# EAGLE design Ionic_Skin_Sensorized_Glove (EAGLE 8.2.1)
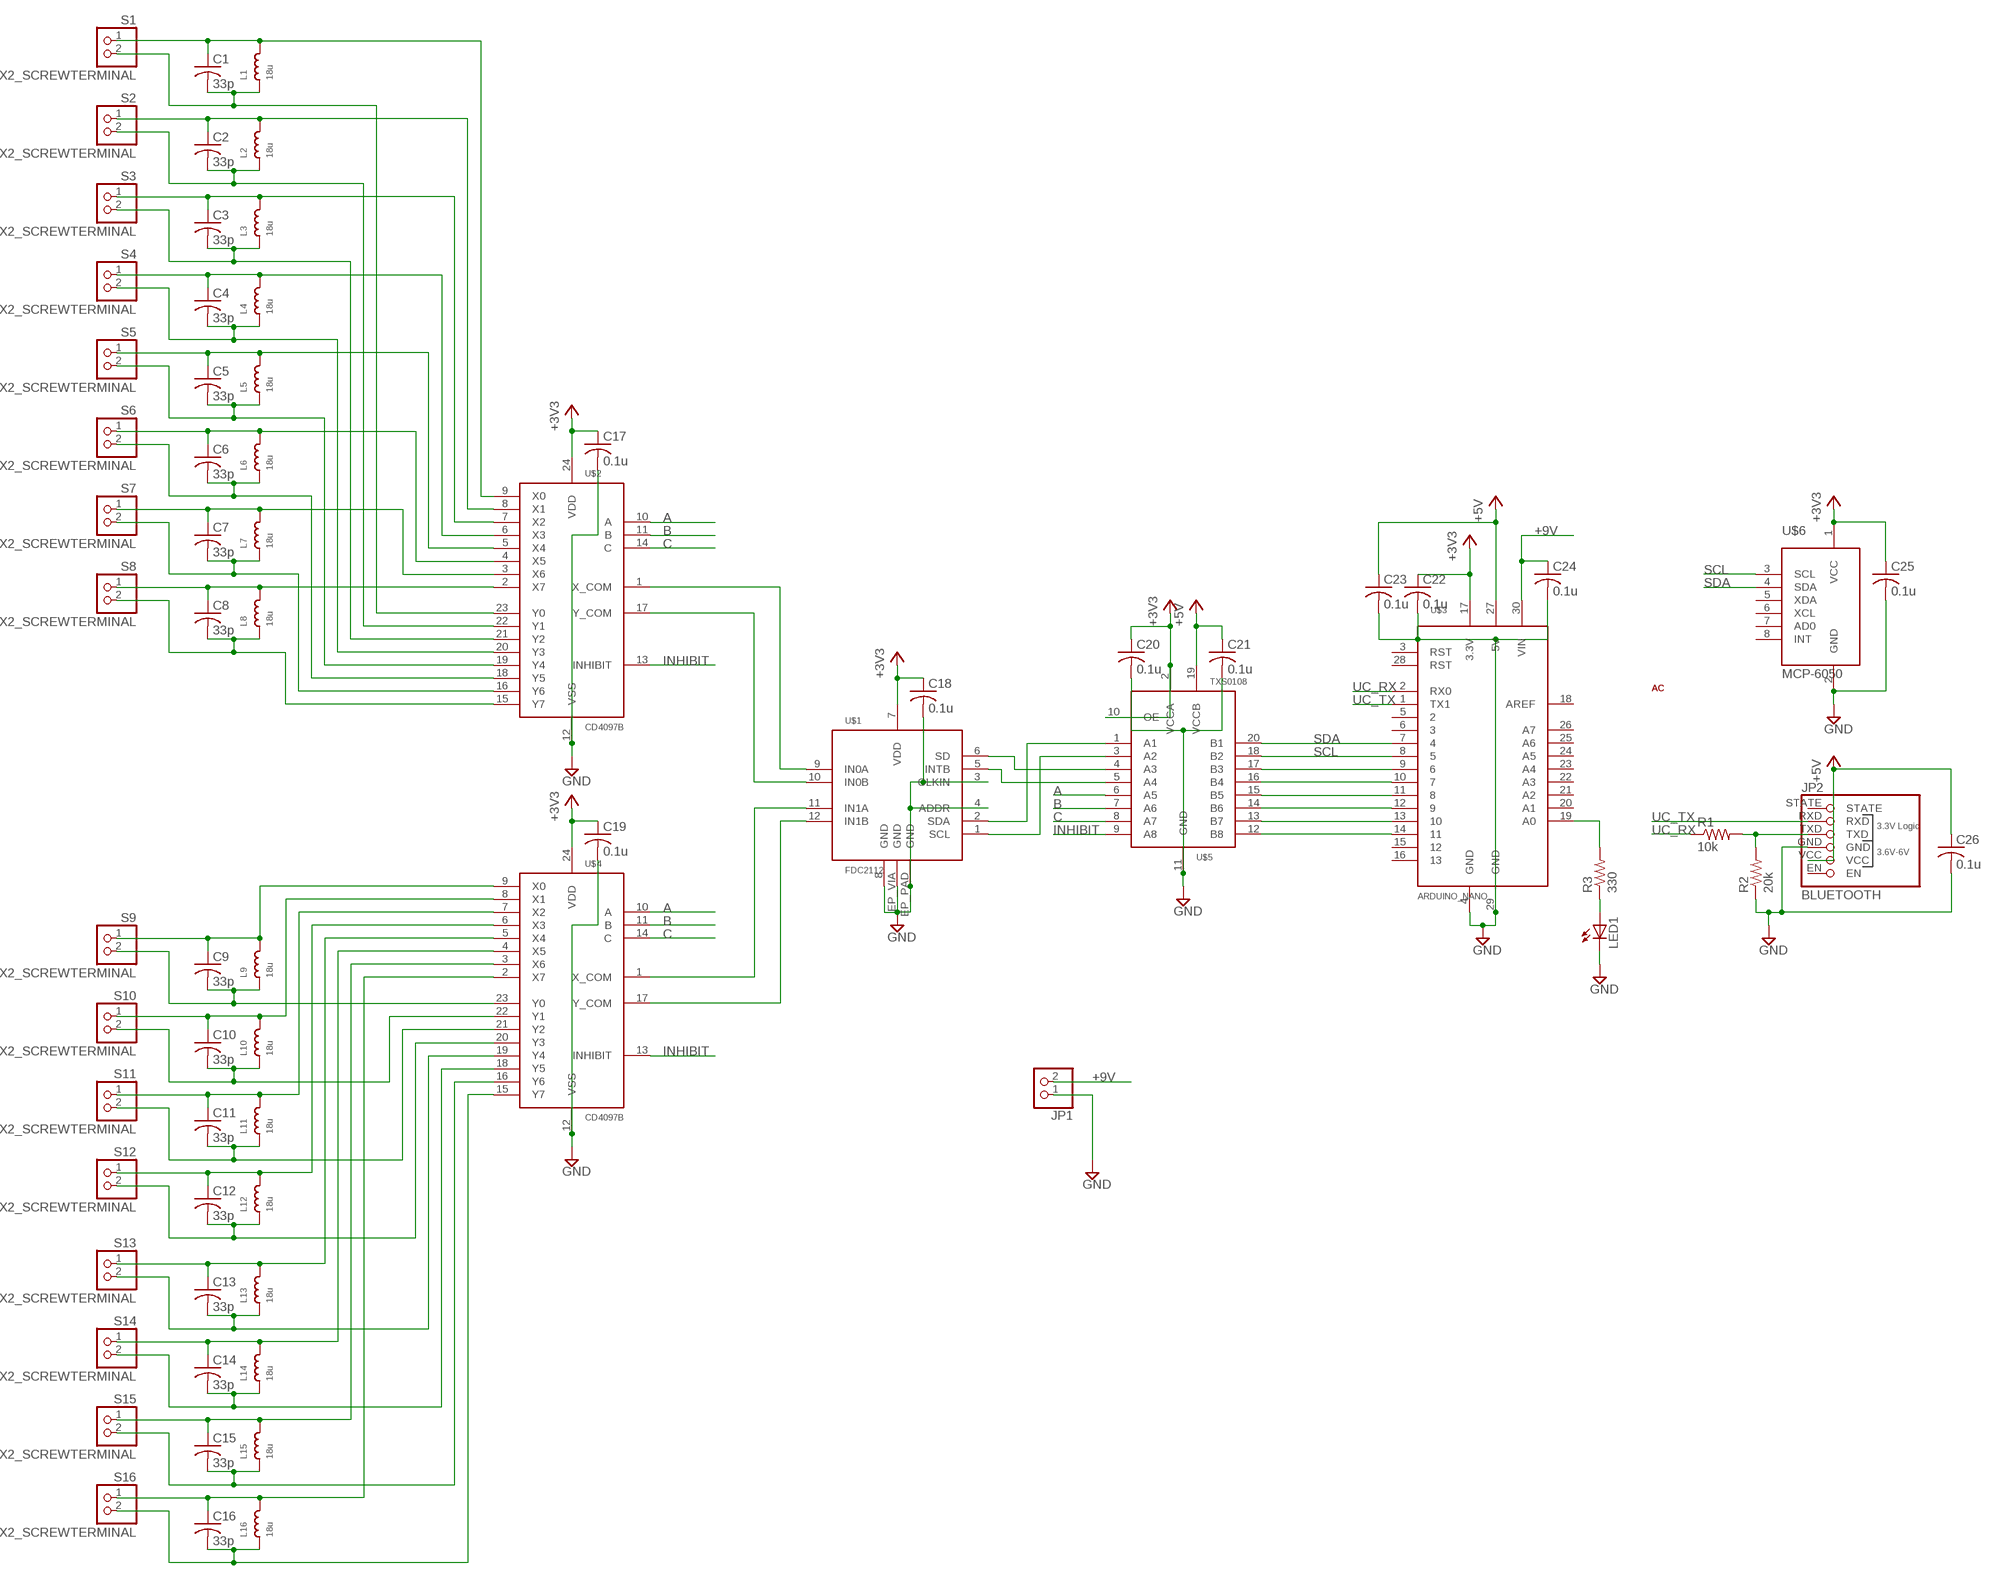
[diagram p0: schematic, sheet 1]

## Parts
C1  33p  C-USC0805  [C0805]
C2  33p  C-USC0805  [C0805]
C3  33p  C-USC0805  [C0805]
C4  33p  C-USC0805  [C0805]
C5  33p  C-USC0805  [C0805]
C6  33p  C-USC0805  [C0805]
C7  33p  C-USC0805  [C0805]
C8  33p  C-USC0805  [C0805]
C9  33p  C-USC0805  [C0805]
C10  33p  C-USC0805  [C0805]
C11  33p  C-USC0805  [C0805]
C12  33p  C-USC0805  [C0805]
C13  33p  C-USC0805  [C0805]
C14  33p  C-USC0805  [C0805]
C15  33p  C-USC0805  [C0805]
C16  33p  C-USC0805  [C0805]
C17  0.1u  C-USC0805  [C0805]
C18  0.1u  C-USC0805  [C0805]
C19  0.1u  C-USC0805  [C0805]
C20  0.1u  C-USC0805  [C0805]
C21  0.1u  C-USC0805  [C0805]
C22  0.1u  C-USC0805  [C0805]
C23  0.1u  C-USC0805  [C0805]
C24  0.1u  C-USC0805  [C0805]
C25  0.1u  C-USC0805  [C0805]
C26  0.1u  C-USC0805  [C0805]
JP1  PINHD-1X2  [1X02]
JP2  BLUETOOTH  HC-06  [HC-06]
L1  18u  INDUCTOR_0805MP  [_0805MP]
L2  18u  INDUCTOR_0805MP  [_0805MP]
L3  18u  INDUCTOR_0805MP  [_0805MP]
L4  18u  INDUCTOR_0805MP  [_0805MP]
L5  18u  INDUCTOR_0805MP  [_0805MP]
L6  18u  INDUCTOR_0805MP  [_0805MP]
L7  18u  INDUCTOR_0805MP  [_0805MP]
L8  18u  INDUCTOR_0805MP  [_0805MP]
L9  18u  INDUCTOR_0805MP  [_0805MP]
L10  18u  INDUCTOR_0805MP  [_0805MP]
L11  18u  INDUCTOR_0805MP  [_0805MP]
L12  18u  INDUCTOR_0805MP  [_0805MP]
L13  18u  INDUCTOR_0805MP  [_0805MP]
L14  18u  INDUCTOR_0805MP  [_0805MP]
L15  18u  INDUCTOR_0805MP  [_0805MP]
L16  18u  INDUCTOR_0805MP  [_0805MP]
LED1  LEDCHIPLED_0805  [CHIPLED_0805]
R1  10k  R-US_R0805  [R0805]
R2  20k  R-US_R0805  [R0805]
R3  330  R-US_R0805  [R0805]
S1  1X2_SCREWTERMINAL  [1X2-2.54MM]
S2  1X2_SCREWTERMINAL  [1X2-2.54MM]
S3  1X2_SCREWTERMINAL  [1X2-2.54MM]
S4  1X2_SCREWTERMINAL  [1X2-2.54MM]
S5  1X2_SCREWTERMINAL  [1X2-2.54MM]
S6  1X2_SCREWTERMINAL  [1X2-2.54MM]
S7  1X2_SCREWTERMINAL  [1X2-2.54MM]
S8  1X2_SCREWTERMINAL  [1X2-2.54MM]
S9  1X2_SCREWTERMINAL  [1X2-2.54MM]
S10  1X2_SCREWTERMINAL  [1X2-2.54MM]
S11  1X2_SCREWTERMINAL  [1X2-2.54MM]
S12  1X2_SCREWTERMINAL  [1X2-2.54MM]
S13  1X2_SCREWTERMINAL  [1X2-2.54MM]
S14  1X2_SCREWTERMINAL  [1X2-2.54MM]
S15  1X2_SCREWTERMINAL  [1X2-2.54MM]
S16  1X2_SCREWTERMINAL  [1X2-2.54MM]
U$1  FDC2112  [WSON-12]
U$2  CD4097B  [TSSOP-24]
U$3  ARDUINO_NANO  [ARDUINO_NANO]
U$4  CD4097B  [TSSOP-24]
U$5  TXS0108  [TSSOP-20]
U$6  MCP-6050  [MCP-6050_BREAKOUT]
U$7  AC_TOP  [AC_TOP]
U$8  AC_BOTTOM  [AC_BOTTOM]

## Nets
+3V3: C17.1 C18.1 C19.1 C20.1 C22.1 C25.1 U$1.7(VDD) U$2.24(VDD) U$3.17(3.3V) U$4.24(VDD) U$5.2(VCCA) U$5.10(OE) U$6.1(VCC)
+5V: C21.1 C23.1 C26.1 JP2.VCC U$3.27(5V) U$5.19(VCCB)
+9V: C24.1 JP1.2 U$3.30(VIN)
A: U$2.10(A) U$4.10(A) U$5.6(A5)
B: U$2.11(B) U$4.11(B) U$5.7(A6)
C: U$2.14(C) U$4.14(C) U$5.8(A7)
GND: C17.2 C18.2 C19.2 C20.2 C21.2 C22.2 C23.2 C24.2 C25.2 C26.2 JP1.1 JP2.GND LED1.C R2.1 U$1.3(CLKIN) U$1.4(ADDR) U$1.8(GND) U$1.EP_PAD(GND) U$1.EP_VIA(GND) U$2.12(VSS) U$3.4(GND) U$3.29(GND) U$4.12(VSS) U$5.11(GND) U$6.2(GND)
INHIBIT: U$2.13(INHIBIT) U$4.13(INHIBIT) U$5.9(A8)
N$1: U$1.10(IN0B) U$2.17(Y_COM)
N$2: U$1.9(IN0A) U$2.1(X_COM)
N$3: U$1.11(IN1A) U$4.1(X_COM)
N$4: U$1.12(IN1B) U$4.17(Y_COM)
N$5: U$1.2(SDA) U$5.1(A1)
N$6: U$1.1(SCL) U$5.3(A2)
N$7: U$1.6(SD) U$5.4(A3)
N$8: U$1.5(INTB) U$5.5(A4)
N$9: LED1.A R3.1
N$10: R3.2 U$3.19(A0)
N$11: U$3.9 U$5.17(B3)
N$12: U$3.10 U$5.16(B4)
N$13: U$3.11 U$5.15(B5)
N$14: U$3.12 U$5.14(B6)
N$15: U$3.13 U$5.13(B7)
N$16: U$3.14 U$5.12(B8)
N$17: C1.2 L1.1 S1.2 U$2.23(Y0)
N$18: C1.1 L1.2 S1.1 U$2.9(X0)
N$19: C2.2 L2.1 S2.2 U$2.22(Y1)
N$20: C2.1 L2.2 S2.1 U$2.8(X1)
N$21: C3.2 L3.1 S3.2 U$2.21(Y2)
N$22: C3.1 L3.2 S3.1 U$2.7(X2)
N$23: C4.2 L4.1 S4.2 U$2.20(Y3)
N$24: C4.1 L4.2 S4.1 U$2.6(X3)
N$25: C5.2 L5.1 S5.2 U$2.19(Y4)
N$26: C5.1 L5.2 S5.1 U$2.5(X4)
N$27: C6.2 L6.1 S6.2 U$2.18(Y5)
N$28: C6.1 L6.2 S6.1 U$2.4(X5)
N$29: C7.2 L7.1 S7.2 U$2.16(Y6)
N$31: C8.2 L8.1 S8.2 U$2.15(Y7)
N$32: C8.1 L8.2 S8.1 U$2.2(X7)
N$37: C7.1 L7.2 S7.1 U$2.3(X6)
N$45: C9.2 L9.1 S9.2 U$4.23(Y0)
N$46: C9.1 L9.2 S9.1 U$4.9(X0)
N$48: C10.2 L10.1 S10.2 U$4.22(Y1)
N$49: C10.1 L10.2 S10.1 U$4.8(X1)
N$51: C11.2 L11.1 S11.2 U$4.21(Y2)
N$52: C11.1 L11.2 S11.1 U$4.7(X2)
N$54: C12.2 L12.1 S12.2 U$4.20(Y3)
N$55: C12.1 L12.2 S12.1 U$4.6(X3)
N$57: C13.2 L13.1 S13.2 U$4.19(Y4)
N$58: C13.1 L13.2 S13.1 U$4.5(X4)
N$60: C14.2 L14.1 S14.2 U$4.18(Y5)
N$61: C14.1 L14.2 S14.1 U$4.4(X5)
N$63: C15.2 L15.1 S15.2 U$4.16(Y6)
N$64: C15.1 L15.2 S15.1 U$4.3(X6)
N$66: C16.2 L16.1 S16.2 U$4.15(Y7)
N$67: C16.1 L16.2 S16.1 U$4.2(X7)
N$76: JP2.TXD R1.2 R2.2
SCL: U$3.8 U$5.18(B2) U$6.3(SCL)
SDA: U$3.7 U$5.20(B1) U$6.4(SDA)
UC_RX: R1.1 U$3.2(RX0)
UC_TX: JP2.RXD U$3.1(TX1)
Unconnected: JP2.EN JP2.STATE U$3.3(RST) U$3.5 U$3.6 U$3.15 U$3.16 U$3.18(AREF) U$3.20(A1) U$3.21(A2) U$3.22(A3) U$3.23(A4) U$3.24(A5) U$3.25(A6) U$3.26(A7) U$3.28(RST) U$6.5(XDA) U$6.6(XCL) U$6.7(AD0) U$6.8(INT)

## Library data of the parts
C1-C26 = rcl:C-US: CAPACITOR, American symbol
JP1 = pinhead:PINHD-1X2: PIN HEADER
JP2 = BreakoutBoards:HC-06: PIN HEADER
L1-L16 = microbuilder:INDUCTOR: Inductors 0603: 10nH Ceramic Inductor - microwire antenna/RF (Digikey: 712-1434-2-ND) 0805: 560nH Ceramic Inductor - RF (Digikey: 553-1047-1-ND) 270nH Ceramic Inductor - Q = 40@250MHz, +-5%, 1 Ohm DC Resistance (Digikey: 535-10506-2-ND) 1007 (2518 Metric) SMT: 10µH 10% 250mOhm 820mA 1007 Inductor (Digikey: 587-2189-1-ND) 22µH 10% 500mOhm 580mA 1007 Inductor (Digikey: 587-2190-1-ND) 47µH 10% 950mOhm 420mA 1007 Inductor (Digikey: 587-2191-1-ND) 47µH 5% 100mOhm 1A 1008 Inductor (Digikey: 732-1816-1-ND) 5.0x5.0mm (Taiyo Yuden NR5040 Series) 6.8µH 20% 2.3A 64mOhm Inductor (Digikey: 587-2374-2-ND) 5.0x5.0mm (TDK VLC5045 Series) 4.7µH 20% 3.3A 34mOhm Inductor (Digikey: 445-6526-1-ND) 6.8µH 20% 2.7A 46mOhm Inductor (Digikey: 445-6527-1-ND) 6.0x6.0mm (TDK VLC6045 Series) 4.7µH 20% 3.8A 27mOhm Inductor (Digikey: 445-6538-2-ND) 6.8µH 20% 3A 41mOhm Inductor (Digikey: 445-6540-1-ND) 6.2µH 30% 2.2A 45mOhm Inductor (Digikey: SRR5028-6R2YCT-ND) - Not TDK VLC6045 but footprint should match 6.0x6.0mm (TDK SLF6045 Series) 6.8uH 30% 2A 33mOhm Inductor (Digikey: 445-4572-1-ND, Mouser: 810-SLF645T6R8N2R0PF)
LED1 = adafruit:LED: LED OSRAM: - CHIPLED LG R971, LG N971, LY N971, LG Q971, LY Q971, LO R971, LY R971 LH N974, LH R974 LS Q976, LO Q976, LY Q976 LO Q996 - Hyper CHIPLED LW Q18S LB Q993, LB Q99A, LB R99A - SideLED LS A670, LO A670, LY A670, LG A670, LP A670 LB A673, LV A673, LT A673, LW A673 LH A674 LY A675 LS A676, LA A676, LO A676, LY A676, LW A676 LS A679, LY A679, LG A679 - Hyper Micro SIDELED® LS Y876, LA Y876, LO Y876, LY Y876 LT Y87S - SmartLED LW L88C, LW L88S LB L89C, LB L89S, LG L890 LS L89K, LO L89K, LY L89K LS L896, LA L896, LO L896, LY L896 - TOPLED LS T670, LO T670, LY T670, LG T670, LP T670 LSG T670, LSP T670, LSY T670, LOP T670, LYG T670 LG T671, LOG T671, LSG T671 LB T673, LV T673, LT T673, LW T673 LH T674 LS T676, LA T676, LO T676, LY T676, LB T676, LH T676, LSB T676, LW T676 LB T67C, LV T67C, LT T67C, LS T67K, LO T67K, LY T67K, LW E67C LS E67B, LA E67B, LO E67B, LY E67B, LB E67C, LV E67C, LT E67C LW T67C LS T679, LY T679, LG T679 LS T770, LO T770, LY T770, LG T770, LP T770 LB T773, LV T773, LT T773, LW T773 LH T774 LS E675, LA E675, LY E675, LS T675 LS T776, LA T776, LO T776, LY T776, LB T776 LHGB T686 LT T68C, LB T68C - Hyper Mini TOPLED® LB M676 - Mini TOPLED Santana® LG M470 LS M47K, LO M47K, LY M47K Source: http://www.osram.convergy.de/
R1-R3 = rcl:R-US_: RESISTOR, American symbol
S1-S16 = Connectors:1X2_SCREWTERMINAL: 3.5mm Terminal block http://www.ladyada.net/library/pcb/eaglelibrary.html
U$1 = Sensor IC:FDC2112
U$2 U$4 = Interface:CD4097B
U$3 = Arduino:ARDUINO_NANO
U$5 = Interface:TXS0108
U$6 = BreakoutBoards:MCP-6050
U$7 = ANDREW_CUSTOM:AC_TOP
U$8 = ANDREW_CUSTOM:AC_BOTTOM

## Board
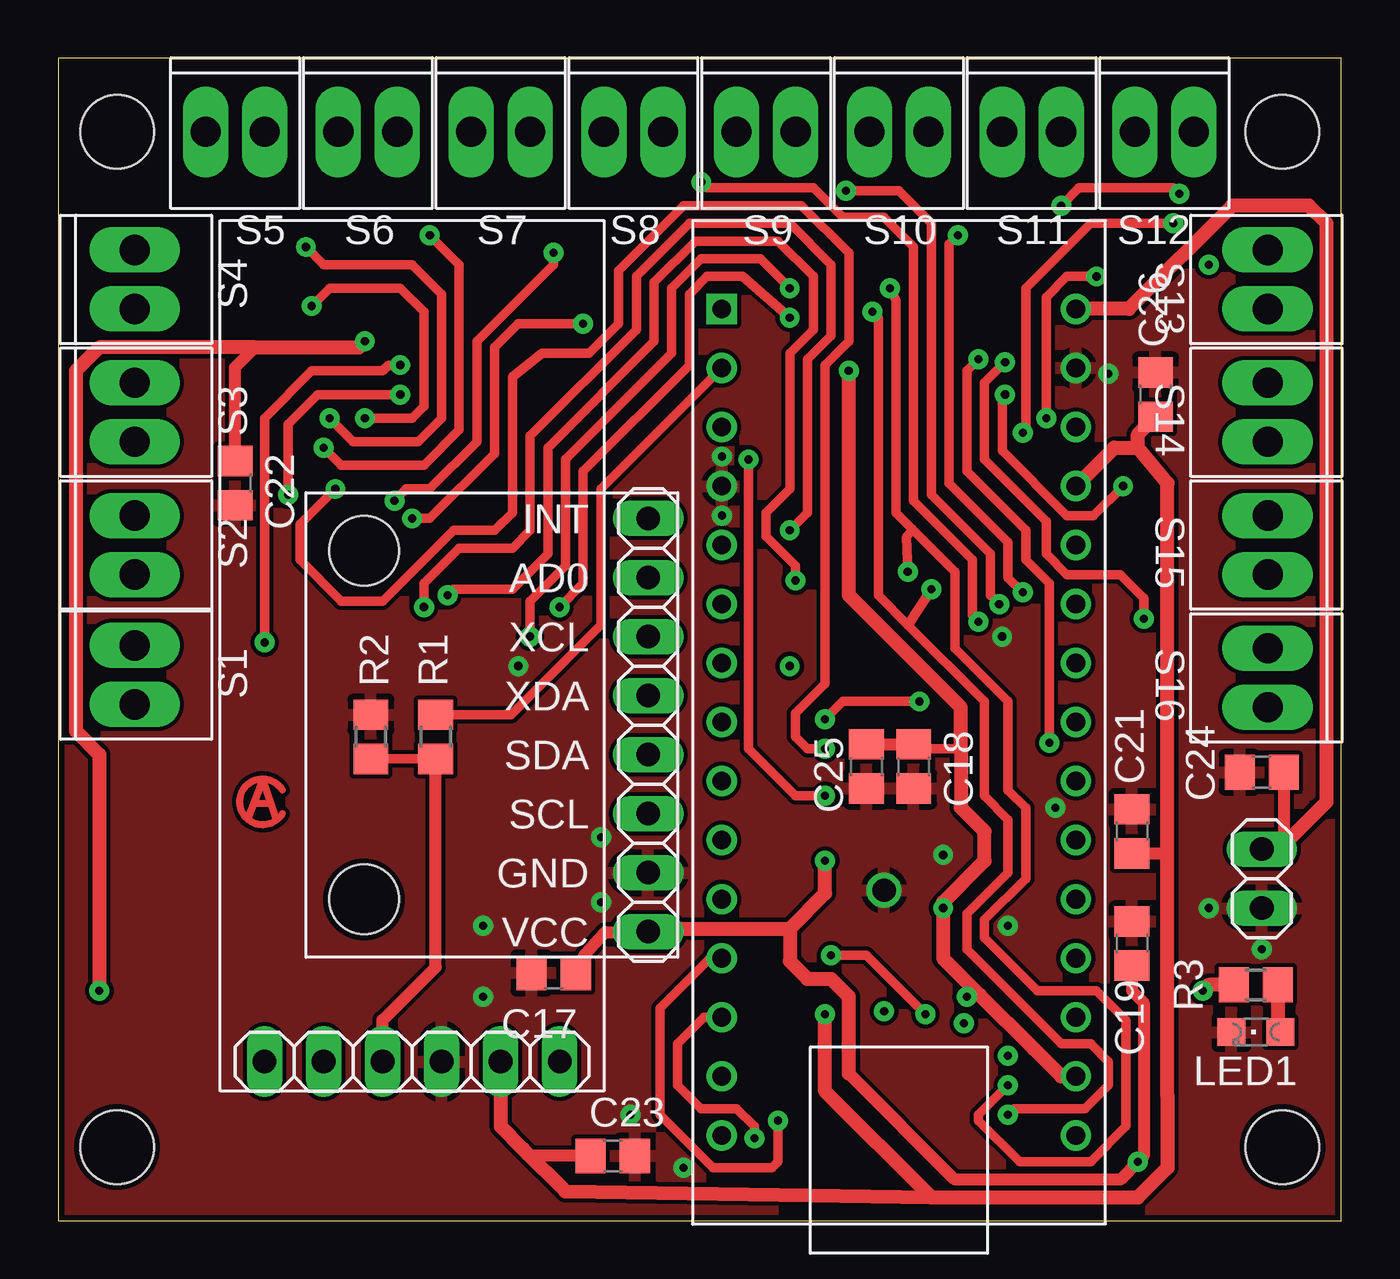
[diagram p1: board, top side]
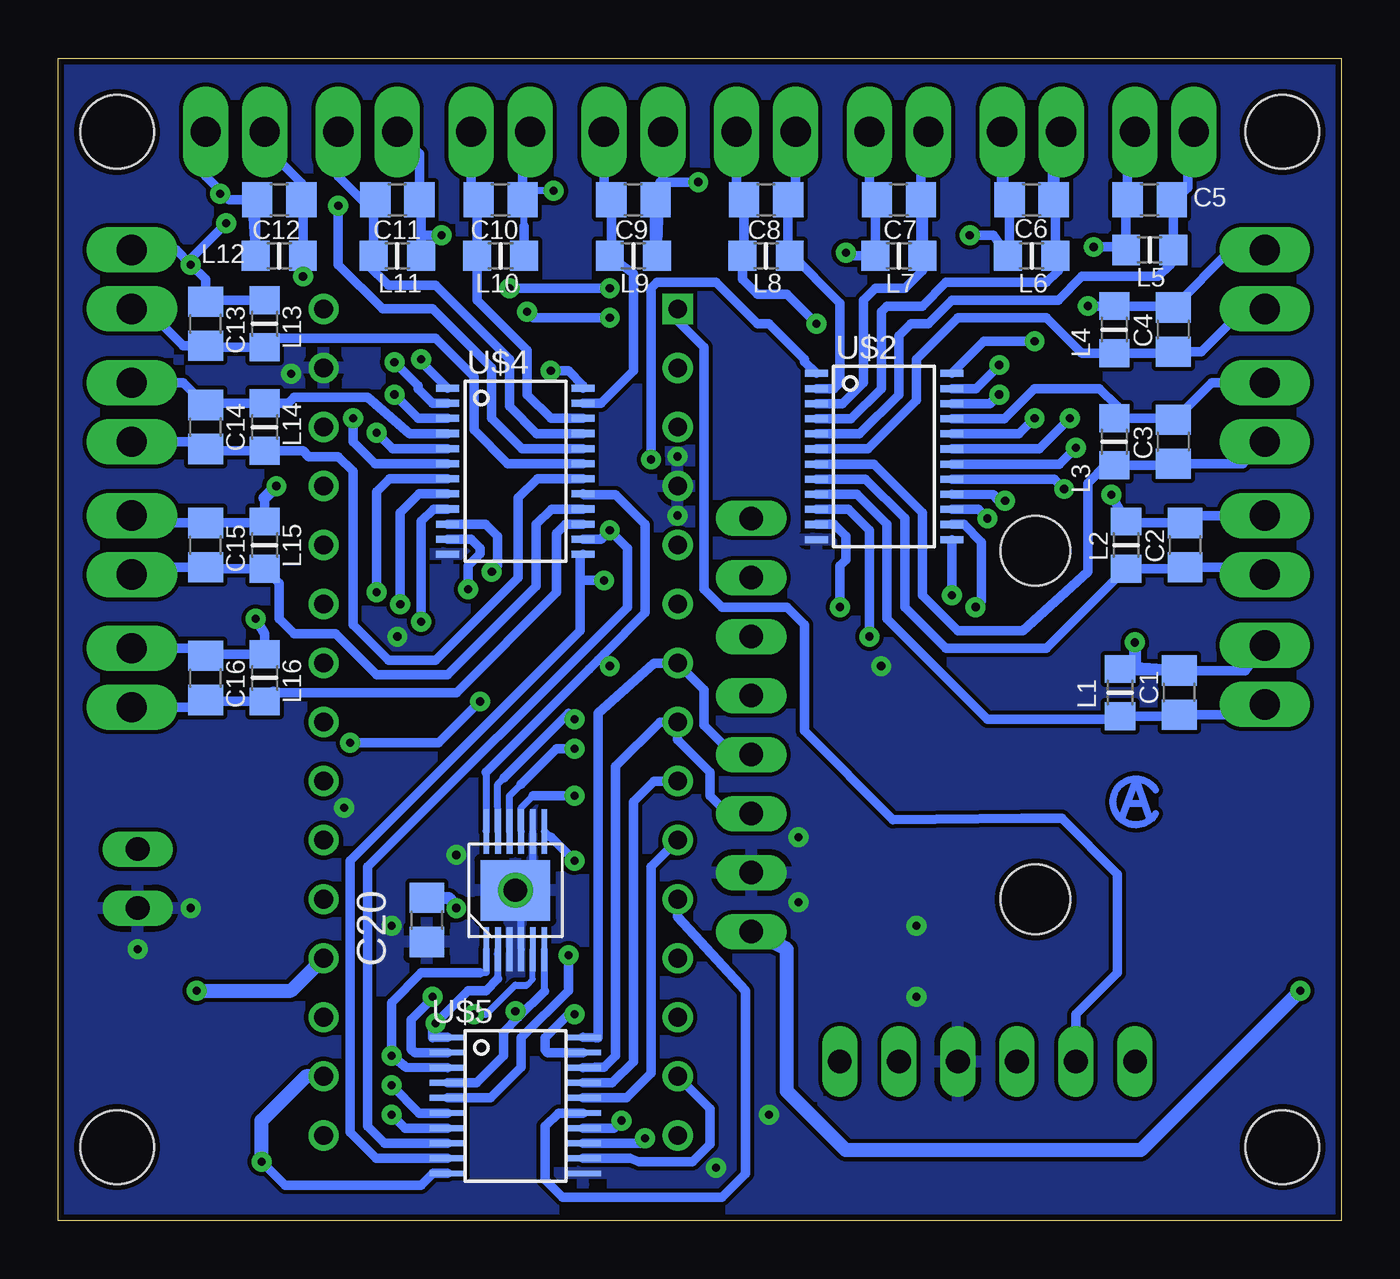
[diagram p2: board, bottom side, seen from below]

Size 55.24 x 50.04 mm. Coordinates in mm from the lower left corner, seen from the top.
Outline: 0,0 55.24,0 55.24,50.04 0,50.04 0,0
Copper layers (1*16): Top 0.035mm / dielectric 1.5mm / Bottom 0.035mm
Design rules "Nomad *": minimum track width 9mil, minimum drill 12mil, track to track 7mil, track to pad 7mil, pad to pad 7mil, via to via 7mil, smd to smd 0mil, copper to edge 10mil, drill to drill 5mil, minimum pad ring 10mil, minimum via ring 10mil, stop-mask expansion 1mil, vias tented up to drill 30mil, thermal gap 10mil
Holes 3.17 mm at 52.7,46.86 2.54,46.86 2.54,3.17 52.7,3.17

### Footprints (pad centres in the part's own frame; a part is rotated, then mirrored left to right if it is on the bottom)
C0805 = smd 1.3 x 1.5: 1 -0.95,0; 2 0.95,0
1X02 = drill 1.016 long: 1 -1.27,0; 2 1.27,0
HC-06 = drill 1.016 long: EN 13.97,1.27; GND 8.89,1.27; RXD 3.81,1.27; STATE 1.27,1.27; TXD 6.35,1.27; VCC 11.43,1.27
_0805MP = smd 1.2 x 1.3: 1 -1.016,0; 2 1.016,0
CHIPLED_0805 = smd 1.2 x 1.2: A 0,-1.05; C 0,1.05
R0805 = smd 1.3 x 1.5: 1 -0.95,0; 2 0.95,0
1X2-2.54MM = drill 1.3 long: 1 -1.27,0; 2 1.27,0
WSON-12 = smd 1.905 x 0.25: 1 -2.535,1.25; 2 -2.535,0.75; 3 -2.535,0.25; 4 -2.535,-0.25; 5 -2.535,-0.75; 6 -2.535,-1.25; 7 2.535,-1.25; 8 2.535,-0.75; 9 2.535,-0.25; 10 2.535,0.25; 11 2.535,0.75; 12 2.535,1.25 | smd 2.6 x 3: EP_PAD 0,0 | drill 1: EP_VIA 0,0
TSSOP-24 = smd 0.305 x 0.991: 1 -3.575,-2.918; 2 -2.925,-2.918; 3 -2.275,-2.918; 4 -1.625,-2.918; 5 -0.975,-2.918; 6 -0.325,-2.918; 7 0.325,-2.918; 8 0.975,-2.918; 9 1.625,-2.918; 10 2.275,-2.918; 11 2.925,-2.918; 12 3.575,-2.918; 13 3.575,2.918; 14 2.925,2.918; 15 2.275,2.918; 16 1.625,2.918; 17 0.975,2.918; 18 0.325,2.918; 19 -0.325,2.918; 20 -0.975,2.918; 21 -1.625,2.918; 22 -2.275,2.918; 23 -2.925,2.918; 24 -3.575,2.918
ARDUINO_NANO = drill 0.8 square: 1 1.27,39.37 | drill 0.8: 2 1.27,36.83; 3 1.27,34.29; 4 1.27,31.75; 5 1.27,29.21; 6 1.27,26.67; 7 1.27,24.13; 8 1.27,21.59; 9 1.27,19.05; 10 1.27,16.51; 11 1.27,13.97; 12 1.27,11.43; 13 1.27,8.89; 14 1.27,6.35; 15 1.27,3.81; 16 16.51,3.81; 17 16.51,6.35; 18 16.51,8.89; 19 16.51,11.43; 20 16.51,13.97; 21 16.51,16.51; 22 16.51,19.05; 23 16.51,21.59; 24 16.51,24.13; 25 16.51,26.67; 26 16.51,29.21; 27 16.51,31.75; 28 16.51,34.29; 29 16.51,36.83; 30 16.51,39.37
TSSOP-20 = smd 0.25 x 1.55: 1 -3.575,-2.918; 2 -2.925,-2.918; 3 -2.275,-2.918; 4 -1.625,-2.918; 5 -0.975,-2.918; 6 -0.325,-2.918; 7 0.325,-2.918; 8 0.975,-2.918; 9 1.625,-2.918; 10 2.275,-2.918; 11 2.275,2.918; 12 1.625,2.918; 13 0.975,2.918; 14 0.325,2.918; 15 -0.325,2.918; 16 -0.975,2.918; 17 -1.625,2.918; 18 -2.275,2.918; 19 -2.925,2.918; 20 -3.575,2.918
MCP-6050_BREAKOUT = drill 1.016 long: 1 1.27,8.89; 2 1.27,6.35; 3 1.27,3.81; 4 1.27,1.27; 5 1.27,-1.27; 6 1.27,-3.81; 7 1.27,-6.35; 8 1.27,-8.89 | hole 3: 13.5,7.5; 13.5,-7.5

### Placement (x,y rotation side)
C1  6.99,22.73 90 bottom
C2  6.73,29.08 90 bottom
C3  7.24,33.53 90 bottom
C4  7.24,38.35 90 bottom
C5  8.26,43.94 180 bottom
C6  13.34,43.94 180 bottom
C7  19.05,43.94 180 bottom
C8  24.77,43.94 180 bottom
C9  30.48,43.94 180 bottom
C10  36.2,43.94 180 bottom
C11  40.64,43.94 180 bottom
C12  45.72,43.94 180 bottom
C13  48.9,38.61 270 bottom
C14  48.9,34.16 270 bottom
C15  48.9,29.08 270 bottom
C16  48.9,23.37 270 bottom
C17  21.34,10.67 180 top
C18  36.83,19.56 270 top
C19  46.23,11.94 90 top
C20  39.37,12.95 270 bottom
C21  46.23,16.76 90 top
C22  7.62,31.75 270 top
C23  23.88,2.79 0 top
C24  51.82,19.3 180 top
C25  34.8,19.56 270 top
C26  47.24,35.56 90 top
JP1  51.82,14.73 90 top
JP2  7.62,5.59 0 top
L1  9.53,22.73 270 bottom
L2  9.27,29.08 270 bottom
L3  9.78,33.53 270 bottom
L4  9.78,38.35 270 bottom
L5  8.26,41.78 0 bottom
L6  13.34,41.53 0 bottom
L7  19.05,41.53 0 bottom
L8  24.77,41.53 0 bottom
L9  30.48,41.53 0 bottom
L10  36.2,41.53 0 bottom
L11  40.64,41.53 0 bottom
L12  45.72,41.53 0 bottom
L13  46.35,38.61 90 bottom
L14  46.35,34.16 90 bottom
L15  46.35,29.08 90 bottom
L16  46.35,23.37 90 bottom
LED1  51.56,8.13 90 top
R1  16.26,20.83 270 top
R2  13.46,20.83 270 top
R3  51.56,10.16 180 top
S1  3.3,23.5 90 top
S2  3.3,29.08 90 top
S3  3.3,34.8 90 top
S4  3.3,40.51 90 top
S5  7.62,46.86 0 top
S6  13.34,46.86 0 top
S7  19.05,46.86 0 top
S8  24.77,46.86 0 top
S9  30.48,46.86 0 top
S10  36.2,46.86 0 top
S11  41.91,46.86 0 top
S12  47.62,46.86 0 top
S13  52.07,40.51 270 top
S14  52.07,34.8 270 top
S15  52.07,29.08 270 top
S16  52.07,23.37 270 top
U$1  35.56,14.22 90 bottom
U$2  19.68,32.89 270 bottom
U$3  27.3,-0.13 0 top
U$4  35.56,32.26 270 bottom
U$5  35.56,4.32 270 bottom
U$6  26.67,21.34 180 top
U$7  8.38,17.02 0 top
U$8  8,17.02 0 top

### Tracks (layer width: path | path; a pad name or v marks a point on that pad's centre or on a via)
+3V3  (via drill 0.35)
  Top 0.406: C18.1 37.02,20.32 38.86,20.32
  Top 0.508: 41.96,7.37 42,7.4 | 34.04,6.35 38.61,1.78 45.72,1.78 v46.48,2.54 46.74,2.79 46.74,9.4 46.23,9.91 C19.1 | C25.1 C18.1 | v38.1,13.46 v38.09,13.46 v38.1,13.47 | C17.1 22.7,11.5 23.55,12.42 25.42,12.42 | C22.1 7.62,36.73 8.48,37.59 | 39.69,9.72 39.18,9.72 v39.12,9.65
  Top 0.61: U$3.17 43.18,6.22 42,7.4 39.69,9.72 38.1,11.3 v38.1,13.46 v38.1,13.47 38.11,13.72 39.88,15.49 39.88,16.76 38.86,17.78 38.86,20.32 38.86,22.1 34.04,26.92 v34.04,36.58 | U$6.1 25.42,12.42 25.53,12.57 31.5,12.57 | 31.5,12.57 31.5,11.18 32.26,10.41 33.27,10.41 34.04,9.65 34.04,6.35 | 31.5,12.57 33.02,14.1 v33.02,15.49 | v13.21,37.85 12.95,37.59 8.48,37.59 1.78,37.59 0.76,36.58 0.76,21.08 1.78,20.07 v1.78,9.91
  Bottom 0.305: 34.03,16.5 U$1.7
  Bottom 0.406: U$4.24 32.64,35.94 33.28,36.58 v34.04,36.58 | v33.02,15.49 34.03,16.5 | U$2.24 15.39,37.85 v13.21,37.85 | U$5.10 39.1,2.04 39.62,1.52 45.47,1.52 v46.48,2.54 | v39.12,9.65 39.05,9.65 40.06,8.65 40.06,7.39 39.87,7.24 U$5.2
  Bottom 0.508: C20.1 38.42,13.9 v38.1,13.46
  Bottom 0.61: U$3.17 44.58,6.22 46.48,4.32 v46.48,2.54 | v1.78,9.91 8.64,3.05 21.34,3.05 23.88,5.59 23.88,11.68 U$6.1
+5V  (via drill 0.35)
  Top 0.508: C21.1 47.78,15.81 47.75,5.37 | C23.1 20.24,2.79 20.03,3.09
  Top 0.61: U$3.27 45.47,33.27 46.48,33.27 | 46.48,33.27 47.75,31.75 47.75,5.37 47.75,2.29 46.48,1.02 37.59,1.02 | 37.59,1.02 33.02,5.59 v33.02,8.89 | JP2.VCC 19.05,4.06 20.03,3.09 21.84,1.27 37.59,1.02 | 46.48,33.27 46.48,33.85 C26.1
  Bottom 0.406: v33.02,8.89 33.27,8.89 34.29,7.87 34.29,7.37 34.17,7.24 U$5.19
+9V
  Top 0.508: C24.1 52.77,16.19 52.59,16.01
  Top 0.61: JP1.2 52.59,16.01 54.61,18.03 54.61,42.93 53.85,43.69 50.55,43.69 46.1,39.24 U$3.30 43.56,39.24
A  (via drill 0.35)
  Top 0.406: v20.32,25.15 20.32,26.67 21.84,28.19 21.84,32.77 26.42,37.34 26.42,40.13 27.69,41.4 30.23,41.4 v31.5,40.13 | v40.89,5.84 39.62,4.57 39.62,4.32 41.4,2.54 44.45,2.54 45.97,4.06 45.97,8.64 44.7,9.91 42.16,9.91 39.88,12.19 39.88,12.95 41.66,14.73 41.66,17.78 40.89,18.54 40.89,22.35 38.61,24.64 38.61,27.94 36.78,29.77 | 36.78,29.77 36.07,30.48 36.07,39.62 v35.81,40.13 | v36.58,27.94 36.52,29.41 36.78,29.77
  Bottom 0.406: U$4.10 36.84,29.98 36.32,29.46 36.32,28.19 v36.58,27.94 | U$5.6 39.7,4.64 v40.89,5.84 | U$2.10 21.22,30.62 20.32,29.72 v20.32,25.15 | v35.81,40.13 v31.5,40.13
B  (via drill 0.35)
  Top 0.406: v21.59,26.42 22.61,27.43 22.61,32.26 27.18,36.83 27.18,39.88 27.94,40.64 29.46,40.64 v31.5,38.86 | v40.89,4.57 41.15,4.83 44.2,4.83 45.21,5.84 45.21,6.86 44.45,7.62 43.18,7.62 39.12,11.68 39.12,13.21 40.89,14.99 40.89,17.27 39.88,18.29 39.88,22.35 36.59,25.64 | v35.05,39.12 35.31,38.86 35.31,26.92 36.59,25.64 | v37.59,27.18 37.08,26.38 36.59,25.64
  Bottom 0.406: U$4.11 37.46,29.33 37.08,28.96 37.08,28.7 37.59,28.19 v37.59,27.18 | v40.89,4.57 40.31,3.99 U$5.7 | U$2.11 21.84,29.97 21.34,29.46 21.34,28.45 21.59,28.19 v21.59,26.42 | v31.5,38.86 34.8,38.86 v35.05,39.12
C  (via drill 0.35)
  Top 0.406: v15.75,26.42 15.75,27.43 17.27,28.96 19.56,28.96 20.32,29.72 20.32,33.78 24.89,38.35 24.89,40.64 27.18,42.93 31.5,42.93 33.27,41.15 33.27,38.1 32.26,37.08 32.26,30.48 v31.5,29.72
  Bottom 0.406: U$4.14 31.87,29.33 31.87,29.34 v31.5,29.72 30.73,28.96 30.73,26.42 41.91,15.24 41.91,4.06 41.19,3.34 U$5.8 | U$2.14 16.25,29.97 15.49,29.21 15.49,26.67 v15.75,26.42
GND  (via drill 0.35)
  Bottom 0.305: U$1.8 34.81,14.22 35.06,13.97 | U$1.4 35.31,13.97 U$1.EP_PAD
  Bottom 0.406: U$1.EP_PAD 35.06,13.97
  other vias: 26.92,2.29 40.64,25.15 42.93,17.78 40.89,12.7 23.37,16.51 23.37,13.72 19.81,23.88 51.82,11.68 49.53,13.46 45.21,36.45 28.57,30.35 28.57,32.89 38.1,15.75 24.64,4.57 18.29,9.65 18.29,12.7
  pour Top: 0,50.04 0,-0.25 55.88,-0.25 55.88,50.04
  pour Bottom: 0,50.04 0,-0.25 55.88,-0.25 55.88,50.04
INHIBIT  (via drill 0.35)
  Top 0.406: v16.76,26.92 17.02,27.18 19.56,27.18 21.08,28.7 21.08,33.27 25.65,37.85 25.65,40.39 27.43,42.16 30.99,42.16 32.51,40.64 32.51,38.35 31.5,37.34 31.5,31.5 30.48,30.48 30.48,29.46 31.75,28.19 v31.75,27.56
  Bottom 0.406: U$4.13 32.77,28.56 32.77,27.43 | 32.77,27.43 32.77,25.4 42.67,15.49 42.67,3.81 41.55,2.69 U$5.9 | U$2.13 v16.76,26.92 | v31.75,27.56 32.64,27.56 32.77,27.43
N$1  (via drill 0.35)
  Top 0.406: v11.94,31.5 10.41,29.97 10.41,28.45 12.19,26.67 13.97,26.67 17.02,29.72 18.8,29.72 19.56,30.48 19.56,36.32 20.83,37.34 22.86,37.34 24.13,38.61 24.13,40.89 26.92,43.69 32,43.69 34.04,41.66 34.04,37.85 33.02,36.83 33.02,23.11 31.75,21.84 31.75,20.83 32.26,20.32 v33.02,20.32
  Bottom 0.305: U$1.10 35.81,18.29 35.31,18.8
  Bottom 0.406: U$2.17 12.36,31.92 v11.94,31.5 | 35.31,18.8 33.78,20.32 v33.02,20.32
N$2  (via drill 0.35)
  Top 0.406: v33.02,18.29 31.75,18.29 29.72,20.32 v29.72,32.77
  Bottom 0.305: U$1.9 35.31,17.78 34.8,18.29
  Bottom 0.406: 34.8,18.29 v33.02,18.29 | U$2.1 23.11,36.98 23.11,37.08 24.64,38.61 25.15,38.61 26.92,40.39 29.46,40.39 29.72,40.13 v29.72,32.77
N$3  (via drill 0.35)
  Top 0.406: v39.62,37.08 39.12,36.58 39.12,32.26 41.66,29.72 41.66,28.45 42.67,27.43 v42.67,20.57 | v37.08,22.35 33.78,22.35 v33.02,21.59
  Bottom 0.305: U$1.11 36.32,18.8 36.06,19.06
  Bottom 0.406: U$4.1 39.62,36.98 v39.62,37.08 | v42.67,20.57 38.86,20.57 v37.08,22.35 | 36.06,19.06 33.27,21.84 v33.02,21.59
N$4  (via drill 0.35)
  Bottom 0.305: 36.83,19.3 36.83,16.78 U$1.12
  Bottom 0.406: U$4.17 32.6,31.24 31.24,31.24 29.97,29.97 29.97,26.16 31.75,24.38 32,24.13 | 32,24.13 32.38,23.75 36.83,19.3 | 32,24.13 31.75,24.13 v31.5,23.88
N$5  (via drill 0.35)
  Bottom 0.305: 36.32,10.41 36.32,11.44 U$1.2
  Bottom 0.406: 36.32,10.41 36.83,9.91 37.59,9.91 v38.99,8.51 39.12,8.38 39.12,7.87 39.1,7.89 U$5.1
N$6  (via drill 0.35)
  Bottom 0.305: U$1.1 36.81,10.69 37.08,10.67
  Bottom 0.406: 37.08,10.67 39.62,10.67 40.89,9.4 40.89,7.37 v40.89,7.11 40.27,6.6 U$5.3
N$7  (via drill 0.35)
  Bottom 0.305: 34.31,9.89 U$1.6
  Bottom 0.406: U$5.4 37.24,5.94 36.07,7.11 36.07,8.13 35.43,8.76 | 35.43,8.76 34.31,9.89 | 35.43,8.76 35.56,8.89 v35.56,9.02
N$8  (via drill 0.35)
  Top 0.406: v33.27,11.43 34.8,11.43 v37.34,8.89
  Bottom 0.254: 35.06,10.15 34.81,10.4 U$1.5
  Bottom 0.305: v37.34,8.89 36.83,8.89 35.57,10.15 35.06,10.15
  Bottom 0.406: U$5.5 36.62,5.29 35.31,6.6 35.31,7.87 33.27,9.91 v33.27,11.43
N$9
  Top 0.61: R3.1 52.51,8.23 LED1.A
N$10  (via drill 0.35)
  Top 0.61: R3.2 49.53,10.16 v49.28,9.91
  Bottom 0.61: v49.28,9.91 45.21,9.91 U$3.19
N$11
  Bottom 0.406: U$5.17 31.39,5.94 30.48,6.86 30.48,18.03 29.59,18.92 U$3.9
N$12
  Bottom 0.406: U$5.16 30.77,5.29 29.72,6.35 29.72,15.24 U$3.10
N$13
  Bottom 0.406: U$5.15 33.71,4.64 34.29,4.06 34.29,1.78 33.53,1.02 26.67,1.02 25.65,2.03 25.65,9.91 28.57,13.08 U$3.11
N$14  (via drill 0.35)
  Top 0.406: v30.99,4.32 30.99,2.54 30.73,2.29 28.19,2.29 25.91,4.57 25.91,9.14 28.07,11.3 U$3.12
  Bottom 0.406: U$5.14 31.31,3.99 v30.99,4.32
N$15  (via drill 0.35)
  Top 0.406: v29.97,3.56 29.97,4.06 29.21,4.83 27.69,4.83 26.67,5.84 26.67,7.62 27.81,8.76 U$3.13
  Bottom 0.406: U$5.13 30.18,3.34 v29.97,3.56
N$16
  Bottom 0.406: U$5.12 30.63,2.69 30.23,2.54 27.94,2.54 27.18,3.3 27.18,4.83 U$3.14
N$17  (via drill 0.35)
  Top 0.406: v14.73,36.83 14.22,36.83 13.97,36.58 10.92,36.58 8.89,34.54 v8.89,24.89
  Bottom 0.406: U$2.23 15.74,35.82 v14.73,36.83 | S1.2 4.13,23.68 C1.2 9.46,23.68
  Bottom 0.508: v8.89,24.89 8.89,23.81 C1.2 | 9.46,23.68 L1.1
N$18
  Bottom 0.406: U$2.9 20.85,31.27 19.56,29.97 19.56,25.91 15.24,21.59 9.65,21.59 | L1.2 7.05,21.72 | C1.1 3.62,21.78 S1.1
  Bottom 0.508: 9.65,21.59 L1.2 | 7.05,21.72 C1.1
N$19  (via drill 0.35)
  Top 0.406: v9.91,31.24 9.91,34.29 11.18,35.56 v14.73,35.56
  Bottom 0.406: U$2.22 15.12,35.17 v14.73,35.56 | S2.2 6.67,30.35 | C2.2 9.46,30.03 | L2.1 v9.91,31.24
  Bottom 0.508: 6.67,30.35 C2.2 | 9.46,30.03 L2.1
N$20
  Bottom 0.406: U$2.8 20.49,31.92 18.8,30.23 18.8,26.42 17.02,24.64 12.7,24.64 L2.2 7.05,28.07 | C2.1 3.88,28.13 S2.1
  Bottom 0.508: 7.05,28.07 C2.1
N$21
  Bottom 0.406: L3.1 9.8,34.52 | L3.1 7.3,34.54 C3.2 7.18,34.48 5.59,36.07 S3.2 | U$2.21 14.5,34.52 13.21,35.81 10.41,35.81 9.65,35.05 9.65,34.67 L3.1
N$22
  Bottom 0.406: U$2.7 20.12,32.57 18.03,30.48 18.03,26.92 16.51,25.4 13.72,25.4 10.92,27.94 10.92,31.75 10.16,32.51 L3.2 7.3,32.51 | C3.1 4.25,32.58 S3.1
  Bottom 0.508: 7.3,32.51 C3.1
N$23  (via drill 0.35)
  Top 0.406: v10.92,39.37 11.68,40.13 14.73,40.13 15.75,39.12 15.75,35.05 15.24,34.54 v13.21,34.54
  Bottom 0.406: v10.92,39.37 L4.1 7.3,39.37 | C4.2 4.76,41.78 S4.2 | U$2.20 13.88,33.87 v13.21,34.54
  Bottom 0.508: 7.3,39.37 C4.2
N$24
  Bottom 0.406: U$2.6 20.38,33.22 18.29,35.31 18.29,37.08 16.51,38.86 12.7,38.86 11.18,37.34 L4.2 7.3,37.34 | C4.1 6.03,37.4 4.19,39.24 S4.1
  Bottom 0.508: 7.3,37.34 C4.1
N$25  (via drill 0.35)
  Top 0.406: v10.67,41.91 11.43,41.15 15.24,41.15 16.51,39.88 16.51,34.54 15.49,33.53 12.7,33.53 v11.68,34.54
  Bottom 0.406: v10.67,41.91 9.4,41.91 | L5.1 9.27,43.62 | C5.2 9.21,46.55 | U$2.19 13.01,33.22 v11.68,34.54
  Bottom 0.508: 9.4,41.91 L5.1 | 9.27,43.62 C5.2 | 9.21,46.55 S5.2
N$26
  Bottom 0.406: U$2.5 20.74,33.87 19.05,35.56 19.05,38.1 18.54,38.61 17.78,38.61 16.76,39.62 12.19,39.62 11.18,40.64 7.87,40.64 7.37,41.15 7.37,41.66 | L5.2 7.24,43.62 | 7.3,43.75 6.6,44.45 6.6,46.61
  Bottom 0.508: 7.37,41.66 L5.2 | 7.24,43.62 C5.1 7.3,43.75 | 6.6,46.61 S5.1
N$27  (via drill 0.35)
  Top 0.406: v16,42.42 17.27,41.15 17.27,34.04 15.75,32.51 12.19,32.51 v11.43,33.27
  Bottom 0.406: C6.2 14.29,41.85 | L6.1 14.99,42.42 v16,42.42 | U$2.18 12.14,32.57 v11.43,33.27
  Bottom 0.508: S6.2 14.61,44.01 C6.2 | 14.29,41.85 L6.1
N$28
  Bottom 0.406: U$2.4 21.11,34.52 19.81,35.81 19.81,39.12 19.56,39.37 18.03,39.37 17.02,40.39 12.7,40.39 12.19,40.89 12.19,41.66 | L6.2 12.32,43.62
  Bottom 0.508: 12.19,41.66 L6.2 | 12.32,43.62 C6.1 12.38,46.54 S6.1
N$29  (via drill 0.35)
  Top 0.406: v21.34,41.66 21.34,41.15 18.03,37.85 18.03,33.53 16,31.5 14.99,31.5 v14.48,30.99
  Bottom 0.406: U$2.16 14.99,31.24 14.76,31.01 v14.48,30.99 | S7.2 20.32,44.01 | 20.07,43.75 L7.1 21.21,41.53 v21.34,41.66
  Bottom 0.508: 20.32,44.01 20.07,43.75 C7.2
N$31  (via drill 0.35)
  Top 0.406: v22.61,38.61 19.81,38.61 18.8,37.59 18.8,33.02 16,30.23 v15.24,30.23
  Bottom 0.406: S8.2 26.04,44.01 C8.2 25.71,41.85 | L8.1 25.78,40.51 25.15,39.88 23.88,39.88 v22.61,38.61 | U$2.15 15.63,30.62 v15.24,30.23
  Bottom 0.508: 25.71,41.85 L8.1
N$32
  Bottom 0.406: U$2.2 21.84,35.82 21.59,36.07 21.59,39.5 23.75,41.66 L8.2 23.82,41.85 C8.1 23.5,44.01 S8.1
N$37
  Bottom 0.406: U$2.3 21.47,35.17 20.57,36.07 20.57,39.62 20.07,40.13 18.8,40.13 18.03,40.89 L7.2 | C7.1 18.1,46.54
  Bottom 0.508: L7.2 18.03,43.62 C7.1 | 18.1,46.54 S7.1
N$45
  Bottom 0.406: S9.2 31.75,44.01 C9.2 31.43,41.85 L9.1 30.48,40.77 30.48,36.58 31.87,35.18 U$4.23
N$46  (via drill 0.35)
  Top 0.406: v27.69,44.7 27.94,44.45 32.51,44.45 33.78,43.18 35.56,43.18 36.83,41.91 36.83,30.99 39.37,28.45 39.37,26.04 v39.62,25.78
  Bottom 0.406: U$4.9 39.09,30.63 39.62,30.1 v39.62,25.78 | v27.69,44.7 29.34,44.7 L9.2 | S9.1 29.21,44.01
  Bottom 0.508: 29.21,44.01 C9.1 29.53,41.85 L9.2
N$48
  Bottom 0.406: 37.21,43.62 L10.1 37.21,39.62 35.05,37.47 35.05,35.56 34.02,34.53 U$4.22 | 37.47,44.01 S10.2
  Bottom 0.508: C10.2 37.47,44.01
  Bottom 0.61: 37.21,43.62 C10.2
N$49  (via drill 0.35)
  Top 0.406: v40.51,26.54 40.13,26.92 40.13,28.7 37.59,31.24 37.59,42.93 36.2,44.32 v33.91,44.32
  Bottom 0.305: 35.18,42.8 35.18,43.62 | v33.91,44.32 34.86,44.32 C10.1
  Bottom 0.406: L10.2 35.18,42.8 | U$4.8 39.71,31.28 40.51,30.48 v40.51,26.54 | C10.1 35.24,46.54 S10.1
  Bottom 0.61: C10.1 35.18,43.62
N$51
  Bottom 0.406: U$4.21 34.65,33.88 35.81,35.05 35.81,37.08 38.99,40.26 41.02,40.26 41.91,41.15 | L11.1 41.66,43.62 | C11.2 41.91,43.69 43.18,44.96 S11.2
  Bottom 0.508: 41.91,41.15 41.91,41.4 L11.1 | 41.66,43.62 C11.2
N$52  (via drill 0.35)
  Top 0.406: v41.53,27.05 40.89,27.69 40.89,29.21 38.35,31.75 38.35,42.04 v38.73,42.42
  Top 0.508: v38.73,42.42 38.61,42.29
  Bottom 0.406: 39.62,43.62 L11.2 39.62,42.42 v38.73,42.42 | C11.1 39.69,45.91 S11.1 | U$4.7 40.97,31.93 41.53,31.37 v41.53,27.05
  Bottom 0.61: 39.62,43.62 C11.1
N$54  (via drill 0.35)
  Top 0.406: v43.18,43.69 43.94,44.45 48.01,44.45 v48.26,44.2
  Bottom 0.406: 46.74,43.62 L12.1 46.86,43.56 | U$4.20 35.27,33.23 36.58,34.54 36.58,36.7 39.12,39.24 41.27,39.24 43.18,41.15 v43.18,43.69 | C12.2 47.88,43.94 48.13,44.2 | 48.13,44.2 48.9,44.96 S12.2 | v48.26,44.2 48.13,44.2
  Bottom 0.61: 46.74,43.62 C12.2
N$55  (via drill 0.35)
  Top 0.406: v42.55,34.54 42.55,39.75 43.43,40.64 v44.7,40.64
  Bottom 0.406: C12.1 44.77,44.64 46.35,46.23 | U$4.6 41.6,32.58 42.55,33.53 v42.55,34.54 | v44.7,40.64 L12.2 44.7,43.62
  Bottom 0.508: 46.35,46.23 S12.1
  Bottom 0.61: 44.7,43.62 C12.1
N$57
  Bottom 0.406: C13.2 49.85,37.66 51.44,39.24 S13.2 | 48.83,37.59 L13.1 46.23,37.97 38.99,37.97 37.34,36.32 37.34,34.04 35.88,32.58 U$4.19
  Bottom 0.61: C13.2 48.83,37.59
N$58  (via drill 0.35)
  Top 0.406: v41.53,33.91 41.66,34.04 41.66,40.13 44.45,42.93 v48.01,42.93
  Bottom 0.406: C13.1 48.9,40.51 v49.53,41.15 | S13.1 50.16,41.78 v49.53,41.15 | 48.83,39.62 L13.2 | U$4.5 40.85,33.23 v41.53,33.91 | v48.01,42.93 49.53,41.4 v49.53,41.15
  Bottom 0.61: C13.1 48.83,39.62
N$60
  Bottom 0.406: 49.21,33.53 S14.2 | 48.83,33.15 L14.1 44.7,33.15 44.45,32.89 43.18,32.89 42.55,32.26 42.55,25.65 41.02,24.13 38.99,24.13 35.43,27.69 35.43,31.11 34.62,31.93 U$4.18
  Bottom 0.61: 49.21,33.53 C14.2 48.83,33.15
N$61
  Bottom 0.406: C14.1 49.85,36.07 S14.1 | 48.83,35.18 L14.2 45.34,35.18 45.09,35.43 41.91,35.43 40.11,33.88 U$4.4
  Bottom 0.61: C14.1 48.83,35.18
N$63
  Bottom 0.406: S15.2 51.75,28.13 C15.2 | 48.83,28.07 L15.1 45.72,27.43 45.72,25.91 45.09,25.27 43.31,25.27 41.53,23.5 38.48,23.5 34.67,27.3 34.67,29.97 34.01,30.63 U$4.16
  Bottom 0.508: C15.2 48.83,28.07
N$64  (via drill 0.35)
  Top 0.406: v40.77,35.56 40.64,35.43 40.64,33.15 43.43,30.35 44.58,30.35 v45.85,31.62
  Bottom 0.406: U$4.3 39.74,34.53 v40.77,35.56 | 46.35,31.11 L15.2 46.42,30.03 C15.1 51.75,30.03 S15.1
  Bottom 0.508: v45.85,31.62 46.35,31.11
N$66
  Bottom 0.406: 48.83,22.35 L16.1 | S16.2 49.22,22.1 C16.2 | U$4.15 33.39,29.98 33.78,29.59 33.78,27.05 38.1,22.73 45.97,22.73
  Bottom 0.508: C16.2 48.83,22.35 | L16.1 45.97,22.73
N$67  (via drill 0.35)
  Top 0.406: v46.74,25.91 46.74,26.8 45.72,27.81 43.43,27.81 42.55,28.7 42.55,30.1 39.88,32.77 39.88,36.07 v40.77,36.96
  Bottom 0.406: v46.74,25.91 46.35,25.27 L16.2 48.83,24.38 | C16.1 49.22,24.64 S16.1 | U$4.2 39.12,35.18 39.75,35.81 39.75,35.94 v40.77,36.96
  Bottom 0.508: C16.1 48.83,24.38
N$76
  Top 0.406: R1.2 R2.2
  Top 0.508: JP2.TXD 13.97,8.64 16.26,10.92 R1.2
SCL
  Bottom 0.406: U$5.18 32.12,6.6 31.75,6.6 31.24,7.11 31.24,19.56 29.34,21.46 U$3.8 28.57,20.7 27.18,19.3 27.18,18.29 26.42,17.53 U$6.3
SDA
  Bottom 0.406: U$5.20 32.12,7.87 32,7.87 32,21.84 29.59,24 U$3.7 27.43,22.86 27.43,21.34 26.16,20.07 U$6.4
UC_RX
  Top 0.406: U$3.2 23.37,31.5 23.37,25.65 19.49,21.78 R1.1
UC_TX
  Bottom 0.406: U$3.1 28.57,38.73 27.43,37.59 27.43,27.18 26.67,26.42 23.88,26.42 23.11,25.65 23.11,21.08 19.3,17.27 13.76,17.32 12.04,17.32 9.65,14.93 9.65,10.67 11.43,8.89 JP2.RXD

### Text on the board
tDocu: +9V | GND | TX | RX | GND | +5V